# Altium schematic sheet POWER.SchDoc
size B
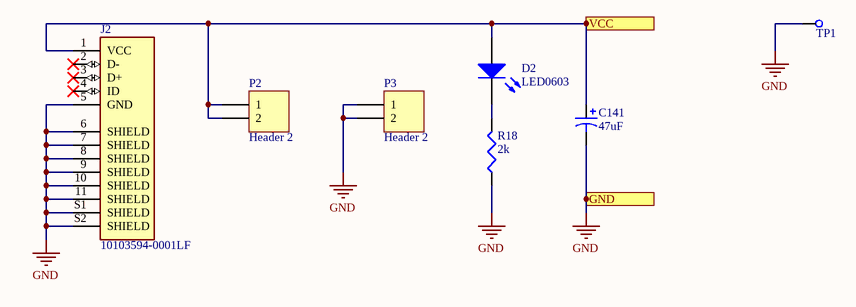
[diagram p0: POWER.SchDoc]

## Parts
C141  47uF  [CAP_TANT_1206_POL]
D2  LED0603  [LED-SMD-0603]
J2  10103594-0001LF  [AMPHENOL_10103594-0001LF]
P2  Header 2  [HDR1X2]
P3  Header 2  [HDR1X2]
R18  2k  [SMD-0402]
TP1  TSW-101-15-T-S  [TSW-101-15-T-S]  (value not drawn)

## Ports
GND, VCC

## Nets
GND: C141.2 J2.5(GND) J2.6(SHIELD) J2.7(SHIELD) J2.8(SHIELD) J2.9(SHIELD) J2.10(SHIELD) J2.11(SHIELD) J2.S1(SHIELD) J2.S2(SHIELD) P3.1 P3.2 R18.1 TP1.1 ; port GND
VCC: C141.1 D2.1(A) J2.1(VCC) P2.1 P2.2 ; port VCC
NetD2_2: D2.2(K) R18.2

Not connected (* = marked no-connect by the designer): J2 2(D-)* 3(D+)* 4(ID)*

## Notes on the sheet
- Title
- Size:
- Date:
- B
- Number:
- Time:
- Revision:
- Sheet
- of
- File:

## Library data of the parts
C141 = CAP_TANT_1206: Polarized Cap, Size 1206 Imperial (3216 Metric), Tantalum
D2 = LED0603: LED 0603
J2 = 10103594-0001LF: USB - micro B USB 2.0 Receptacle Connector 5 Position Surface Mount, Right Angle; Through Hole; MF: Amphenol ICC (FCI); Package: None; MP: 10103594-0001LF; Check_prices: https://www.snapeda.com/parts/10103594-0001LF/Amphenol%20FCI/view-part/5161044/?ref=eda; Purchase-URL: https://pricing.snapeda.com/search/part/10103594-0001LF/?ref=eda; Value: *; Availability: Good; Price: None; SnapEDA_Link: https://www.snapeda.com/parts/10103594-0001LF/Amphenol%20FCI/view-part/5161044/?ref=snap
P2 P3 = Header 2: Header, 2-Pin; LatestRevisionDate: 17-Jul-2002; LatestRevisionNote: Re-released for DXP Platform.; Publisher: Altium Limited
R18 = RES0402: Resistor-0402
TP1 = TSW-101-15-T-S: CONN HEADER VERT 1POS